# EAGLE design untitled (EAGLE 5.06)
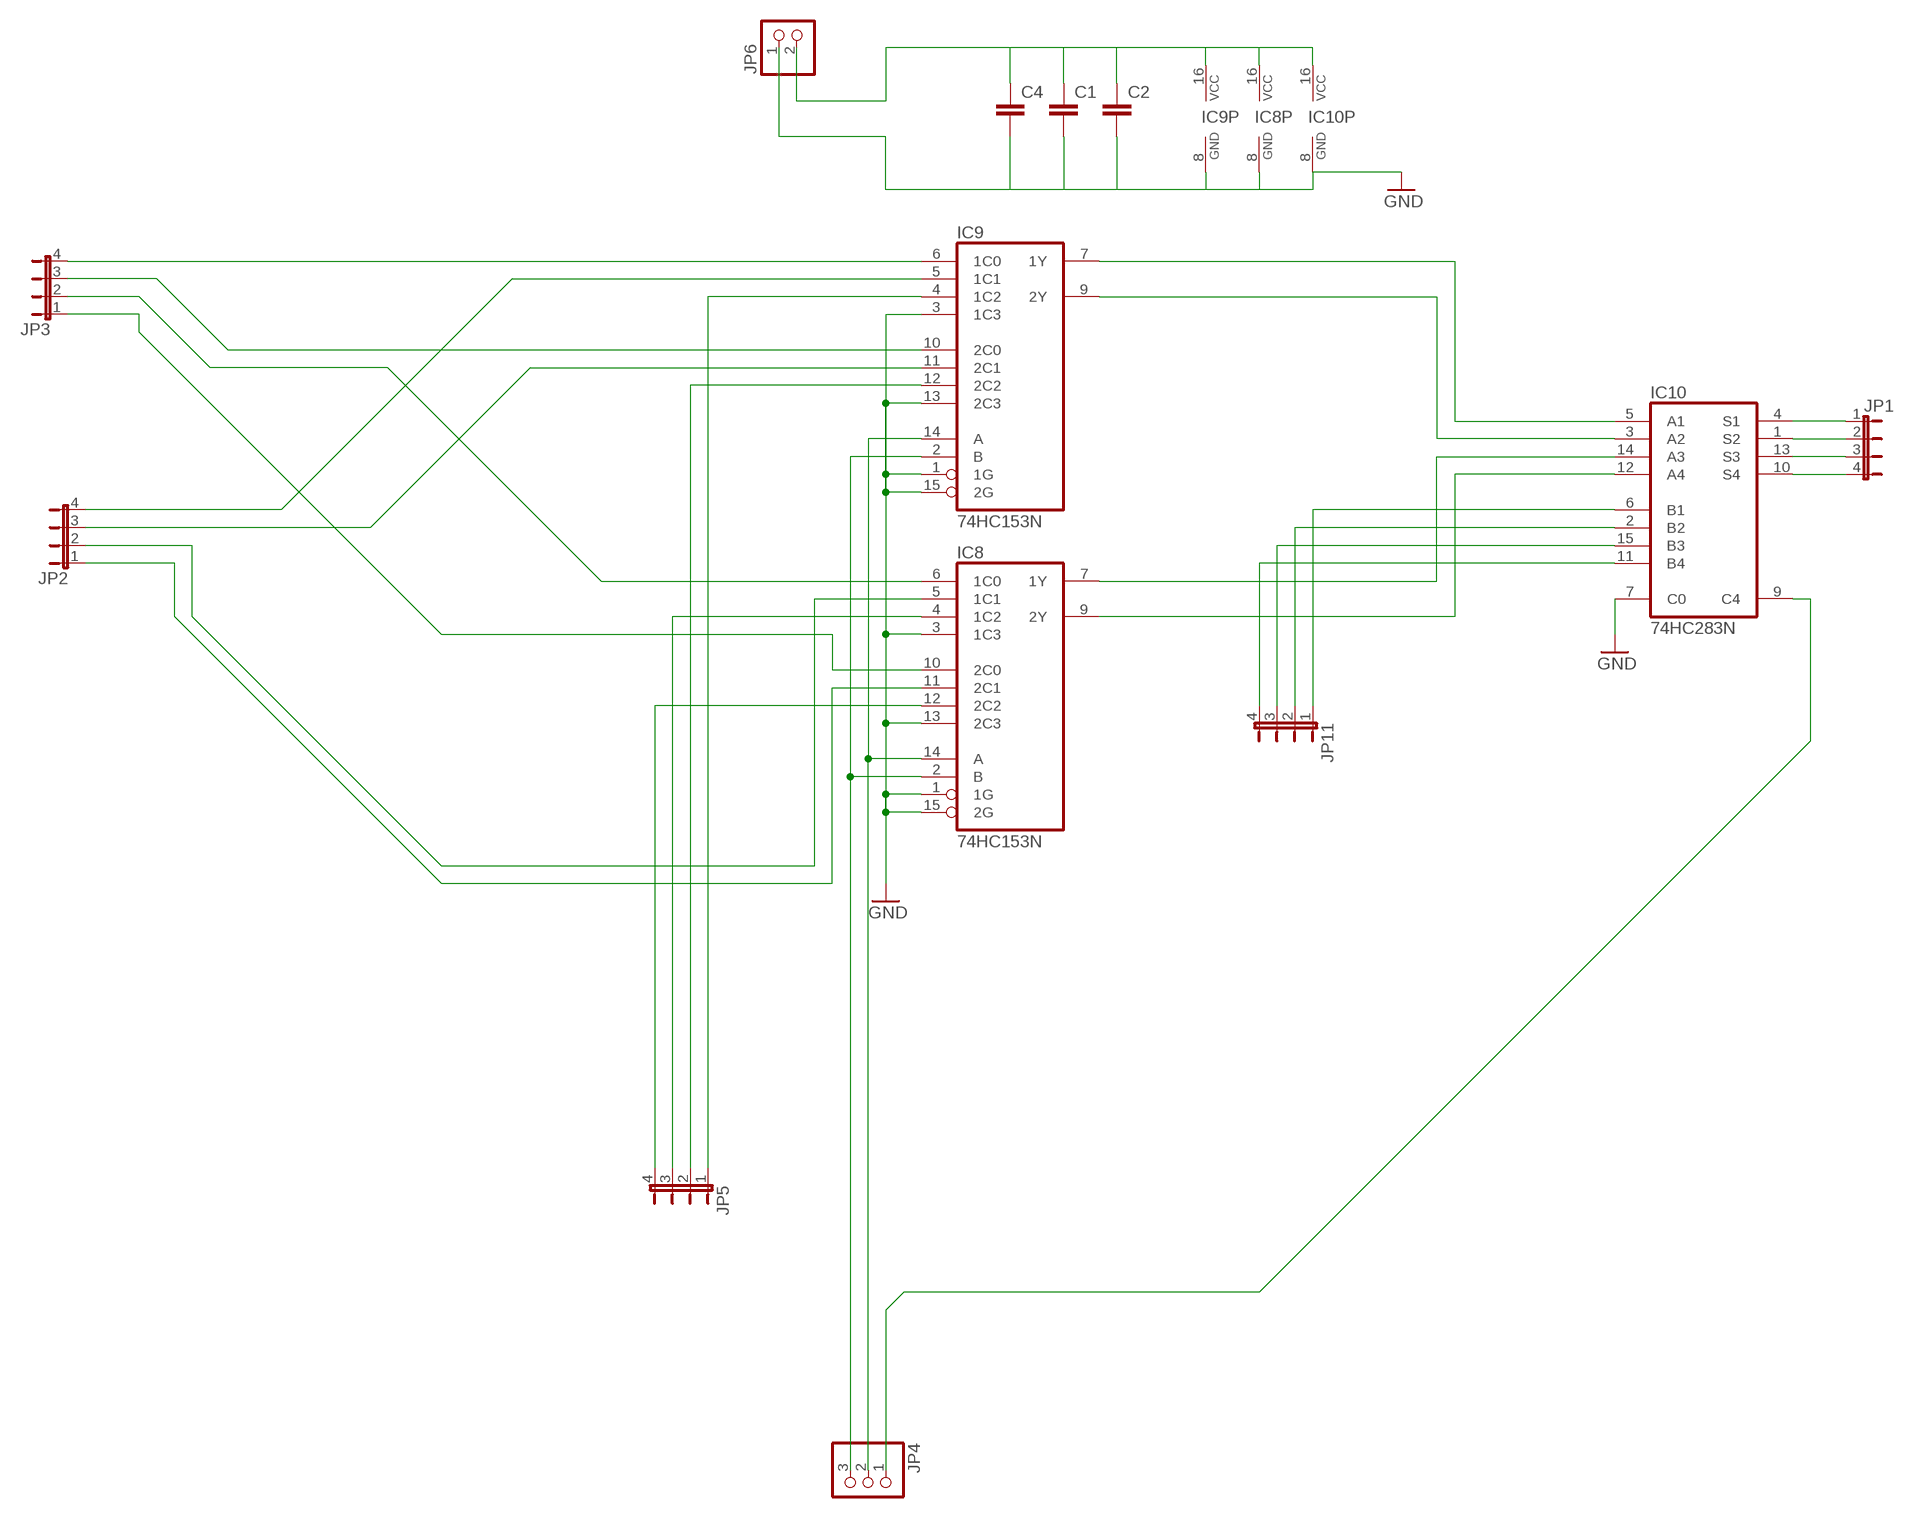
[diagram p0: schematic, sheet 1]

## Parts
C1  C-EU050-030X075  [C050-030X075]
C2  C-EU050-030X075  [C050-030X075]
C4  C-EU050-030X075  [C050-030X075]
IC8  74HC153N  [DIL16]
IC9  74HC153N  [DIL16]
IC10  74HC283N  [DIL16]
JP1  JP4E  [JP4]
JP2  JP4E  [JP4]
JP3  JP4E  [JP4]
JP4  PINHD-1X3  [1X03]
JP5  JP4E  [JP4]
JP6  PINHD-1X2  [1X02]
JP11  JP4E  [JP4]

## Nets
GND: C1.2 C2.2 C4.2 IC8.1(1G) IC8.3(1C3) IC8.8(GND) IC8.13(2C3) IC8.15(2G) IC9.1(1G) IC9.3(1C3) IC9.8(GND) IC9.13(2C3) IC9.15(2G) IC10.7(C0) IC10.8(GND) JP6.1
N$2: C1.1 C2.1 C4.1 IC8.16(VCC) IC9.16(VCC) IC10.16(VCC) JP6.2
N$149: IC9.7(1Y) IC10.5(A1)
N$150: IC9.9(2Y) IC10.3(A2)
N$152: IC8.7(1Y) IC10.14(A3)
N$154: IC8.9(2Y) IC10.12(A4)
N$177: IC10.9(C4) JP4.1
N$182: IC8.14(A) IC9.14(A) JP4.2
N$183: IC10.11(B4) JP11.4
N$184: IC10.15(B3) JP11.3
N$185: IC10.2(B2) JP11.2
N$186: IC10.6(B1) JP11.1
N$190: IC8.2(B) IC9.2(B) JP4.3
N$196: IC8.11(2C1) JP2.1
N$197: IC8.10(2C0) JP3.1
N$198: IC8.5(1C1) JP2.2
N$199: IC8.6(1C0) JP3.2
N$200: IC9.6(1C0) JP3.4
N$201: IC9.10(2C0) JP3.3
N$202: IC9.5(1C1) JP2.4
N$203: IC9.11(2C1) JP2.3
N$204: IC8.12(2C2) JP5.4
N$205: IC8.4(1C2) JP5.3
N$206: IC9.12(2C2) JP5.2
N$207: IC9.4(1C2) JP5.1
N$212: IC10.13(S3) JP1.3
N$214: IC10.10(S4) JP1.4
N$215: IC10.4(S1) JP1.1
N$216: IC10.1(S2) JP1.2

## Library data of the parts
C1 C2 C4 = resistor:C-EU: CAPACITOR, European symbol
IC8 IC9 = 74xx-eu:74*153: Dual 4-line to 1-line data SELECTOR/MULTIPLEXER
IC10 = 74xx-eu:74*283: 4-bit binary FULL ADDER, fast carry
JP1-JP3 JP5 JP11 = jumper:JP4E: JUMPER
JP4 = pinhead:PINHD-1X3: PIN HEADER
JP6 = pinhead:PINHD-1X2: PIN HEADER

## Board
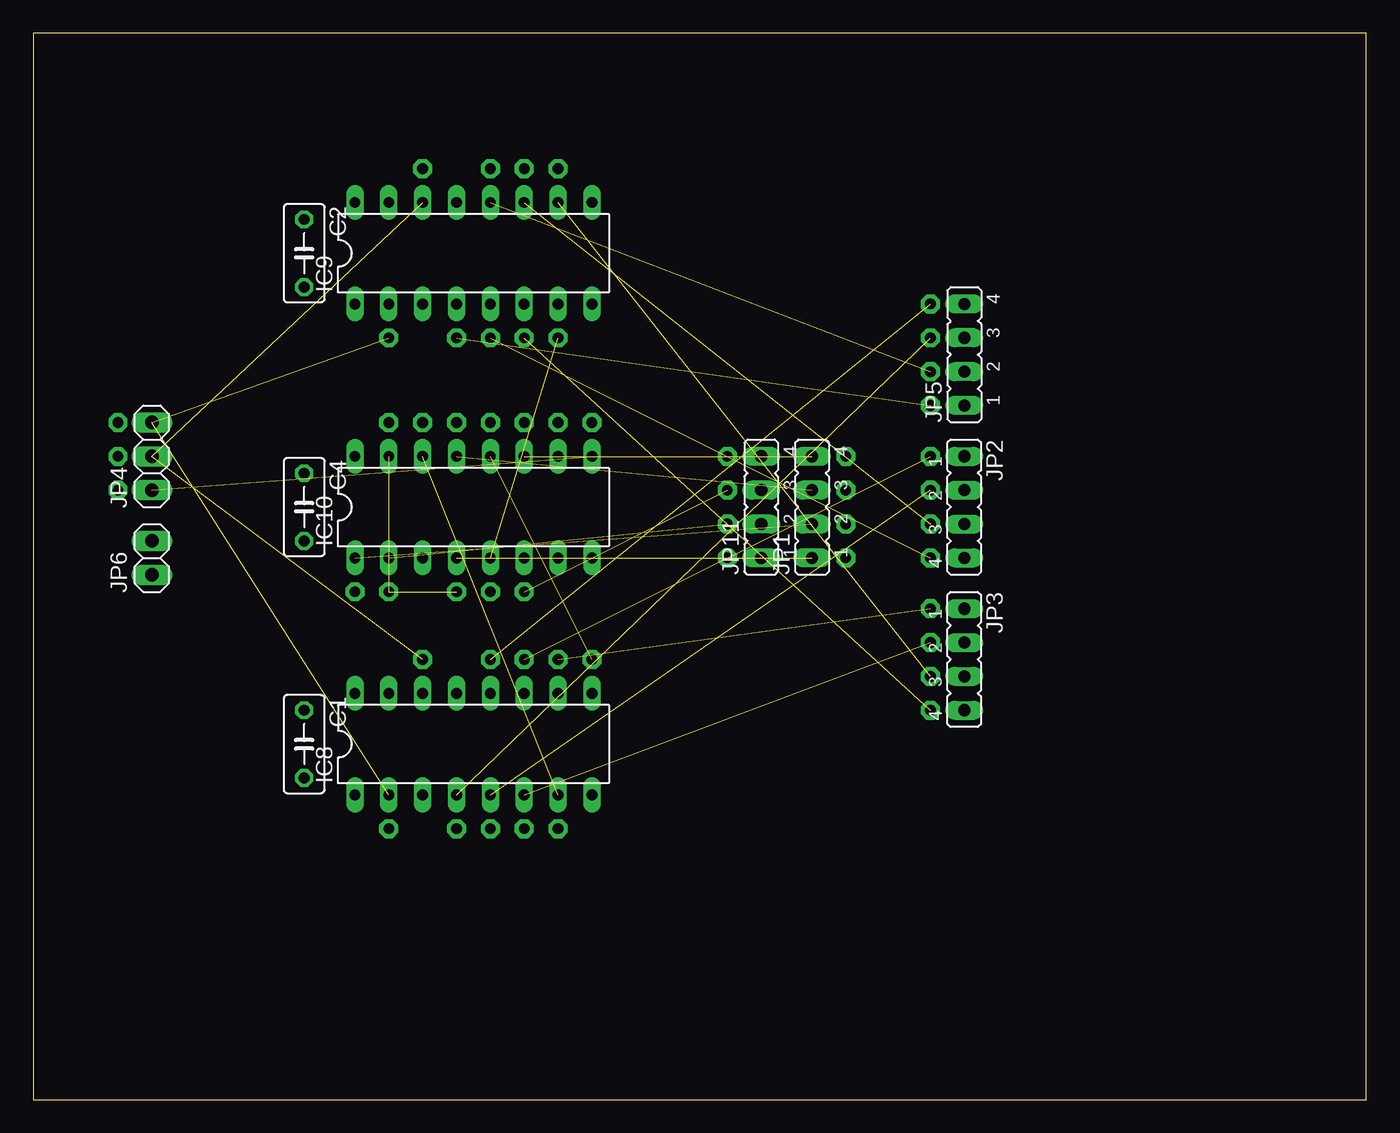
[diagram p1: board, top side]
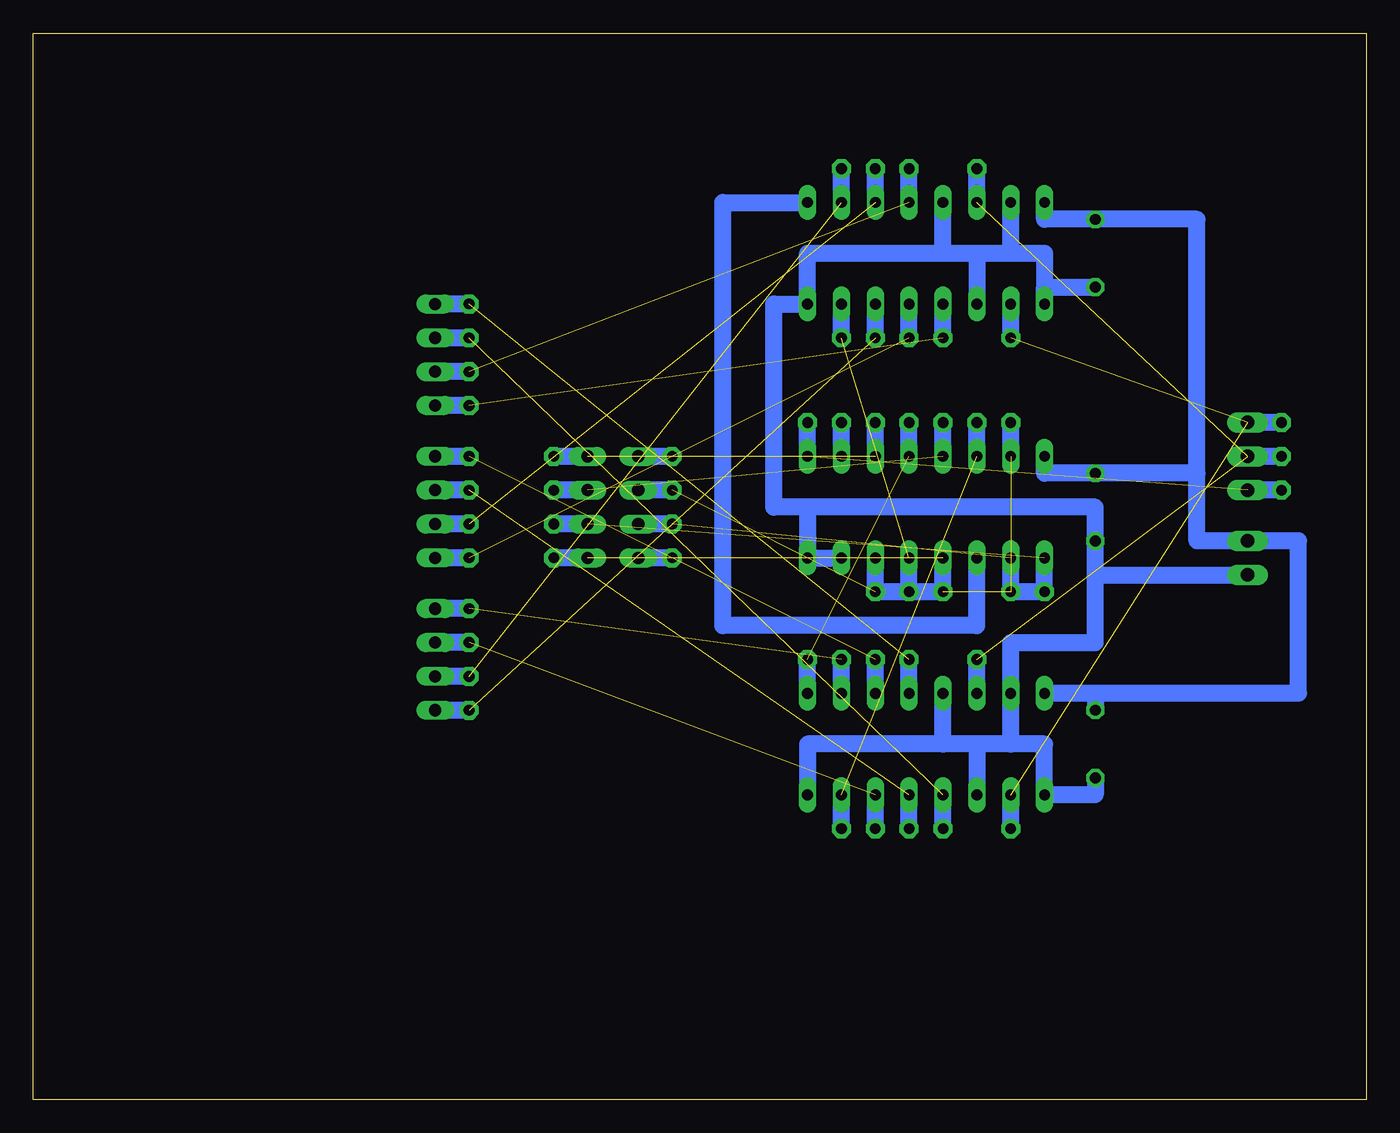
[diagram p2: board, bottom side, seen from below]

Size 100 x 80 mm. Coordinates in mm from the lower left corner, seen from the top.
Outline: 0,0 100,0 100,80 0,80 0,0
Copper layers (1*16): Top 0.035mm / dielectric 1.5mm / Bottom 0.035mm
Design rules "default": minimum track width 10mil, minimum drill 24mil, track to track 8mil, track to pad 8mil, pad to pad 8mil, via to via 8mil, smd to smd 8mil, copper to edge 40mil, drill to drill 8mil, minimum pad ring 10mil, minimum via ring 8mil, stop-mask expansion 4mil, vias tented up to drill 0mil, thermal gap 10mil

### Footprints (pad centres in the part's own frame; a part is rotated, then mirrored left to right if it is on the bottom)
C050-030X075 = drill 0.813 octagon: 1 -2.54,0; 2 2.54,0
DIL16 = drill 0.813 long: 1 -8.89,-3.81; 2 -6.35,-3.81; 3 -3.81,-3.81; 4 -1.27,-3.81; 5 1.27,-3.81; 6 3.81,-3.81; 7 6.35,-3.81; 8 8.89,-3.81; 9 8.89,3.81; 10 6.35,3.81; 11 3.81,3.81; 12 1.27,3.81; 13 -1.27,3.81; 14 -3.81,3.81; 15 -6.35,3.81; 16 -8.89,3.81
JP4 = drill 0.914 long: 1 -3.81,0; 2 -1.27,0; 3 1.27,0; 4 3.81,0
1X03 = drill 1.016 long: 1 -2.54,0; 2 0,0; 3 2.54,0
1X02 = drill 1.016 long: 1 -1.27,0; 2 1.27,0

### Placement (x,y rotation side)
C1  20.32,26.67 270 top
C2  20.32,63.5 270 top
C4  20.32,44.45 270 top
IC8  33.02,26.67 0 top
IC9  33.02,63.5 0 top
IC10  33.02,44.45 0 top
JP1  58.42,44.45 90 top
JP2  69.85,44.45 270 top
JP3  69.85,33.02 270 top
JP4  8.89,48.26 90 top
JP5  69.85,55.88 90 top
JP6  8.89,40.64 90 top
JP11  54.61,44.45 90 top

### Tracks (layer width: path | path; a pad name or v marks a point on that pad's centre or on a via)
GND
  Bottom 1.27: C2.2 24.13,60.96 IC9.1 24.13,63.5 26.67,63.5 | 29.21,63.5 26.67,63.5 | 31.75,63.5 29.21,63.5 | 31.75,63.5 41.91,63.5 IC9.8 44.45,59.69 44.45,44.45 41.91,44.45 | 31.75,63.5 IC9.13 | 26.67,63.5 IC9.15 | 29.21,63.5 IC9.3 | 41.91,44.45 20.32,44.45 C4.2 20.32,39.37 | 41.91,44.45 IC10.8 IC10.7 | C1.2 20.32,22.86 IC8.1 24.13,26.67 26.67,26.67 | 26.67,26.67 29.21,26.67 | 29.21,26.67 31.75,26.67 | 31.75,26.67 41.91,26.67 IC8.8 | 26.67,26.67 IC8.15 26.67,34.29 20.32,34.29 20.32,39.37 | 31.75,26.67 IC8.13 | 29.21,26.67 IC8.3 | 20.32,39.37 JP6.1
N$2
  Bottom 1.27: IC9.16 24.13,66.04 C2.1 12.7,66.04 12.7,46.99 | IC10.16 24.13,46.99 C4.1 12.7,46.99 | 20.32,30.48 C1.1 | 20.32,30.48 IC8.16 | 12.7,46.99 12.7,41.91 JP6.2 5.08,41.91 5.08,30.48 20.32,30.48
N$149  (1 unrouted)
  Bottom 1.27: 39.37,57.15 IC9.7 | 34.29,38.1 IC10.5
N$150
  Bottom 1.27: IC9.9 48.26,67.31 48.26,35.56 29.21,35.56 IC10.3
N$152  (via drill 0.8 pad 1.42)  (1 unrouted)
  Bottom 1.27: 39.37,20.32 IC8.7 | IC10.14 v29.21,50.8
N$154  (1 unrouted)
  Bottom 1.27: IC8.9 41.91,33.02 | IC10.12 34.29,50.8
N$177  (1 unrouted)
  Bottom 1.27: 6.35,45.72 JP4.1 | IC10.9 41.91,50.8
N$182  (2 unrouted)
  Bottom 1.27: 6.35,48.26 JP4.2 | IC8.14 29.21,33.02 | IC9.14 29.21,69.85
N$183  (1 unrouted)
  Bottom 1.27: 52.07,48.26 JP11.4 | IC10.11 36.83,50.8
N$184  (via drill 0.8 pad 1.42)  (3 unrouted)
  Bottom 1.27: 52.07,45.72 JP11.3 | IC10.15 v26.67,50.8 | v24.13,38.1 v26.67,38.1 | v31.75,38.1 v34.29,38.1 | v34.29,38.1 v36.83,38.1 v34.29,38.1
N$185  (1 unrouted)
  Bottom 1.27: 52.07,43.18 JP11.2 | 26.67,38.1 IC10.2
N$186  (1 unrouted)
  Bottom 1.27: 52.07,40.64 JP11.1 | 36.83,38.1 IC10.6
N$190  (2 unrouted)
  Bottom 1.27: 6.35,50.8 JP4.3 | 26.67,20.32 IC8.2 | 26.67,57.15 IC9.2
N$196  (1 unrouted)
  Bottom 1.27: IC8.11 36.83,33.02 | 67.31,48.26 JP2.1
N$197  (1 unrouted)
  Bottom 1.27: IC8.10 39.37,33.02 | 67.31,36.83 JP3.1
N$198  (1 unrouted)
  Bottom 1.27: 34.29,20.32 IC8.5 | 67.31,45.72 JP2.2
N$199  (1 unrouted)
  Bottom 1.27: 36.83,20.32 IC8.6 | 67.31,34.29 JP3.2
N$200  (1 unrouted)
  Bottom 1.27: 67.31,29.21 JP3.4 | 36.83,57.15 IC9.6
N$201  (1 unrouted)
  Bottom 1.27: 67.31,31.75 JP3.3 | IC9.10 39.37,69.85
N$202  (1 unrouted)
  Bottom 1.27: 67.31,40.64 JP2.4 | 34.29,57.15 IC9.5
N$203  (1 unrouted)
  Bottom 1.27: 67.31,43.18 JP2.3 | IC9.11 36.83,69.85
N$204  (1 unrouted)
  Bottom 1.27: IC8.12 34.29,33.02 | 67.31,59.69 JP5.4
N$205  (1 unrouted)
  Bottom 1.27: 31.75,20.32 IC8.4 | 67.31,57.15 JP5.3
N$206  (1 unrouted)
  Bottom 1.27: 67.31,54.61 JP5.2 | IC9.12 34.29,69.85
N$207  (1 unrouted)
  Bottom 1.27: 67.31,52.07 JP5.1 | 31.75,57.15 IC9.4
N$212  (via drill 0.8 pad 1.42)  (1 unrouted)
  Bottom 1.27: JP1.3 60.96,45.72 | IC10.13 v31.75,50.8
N$214  (1 unrouted)
  Bottom 1.27: JP1.4 60.96,48.26 | IC10.10 39.37,50.8
N$215  (1 unrouted)
  Bottom 1.27: JP1.1 60.96,40.64 | 31.75,38.1 IC10.4
N$216  (1 unrouted)
  Bottom 1.27: JP1.2 60.96,43.18 | 24.13,38.1 IC10.1
S$1  (via drill 0.8 pad 1.42)
  other vias: 29.21,69.85
S$2  (via drill 0.8 pad 1.42)
  other vias: 34.29,69.85
S$3  (via drill 0.8 pad 1.42)
  other vias: 36.83,69.85
S$4  (via drill 0.8 pad 1.42)
  other vias: 39.37,69.85
S$5  (via drill 0.8 pad 1.42)
  other vias: 26.67,57.15
S$6  (via drill 0.8 pad 1.42)
  other vias: 31.75,57.15
S$7  (via drill 0.8 pad 1.42)
  other vias: 34.29,57.15
S$8  (via drill 0.8 pad 1.42)
  other vias: 36.83,57.15
S$9  (via drill 0.8 pad 1.42)
  other vias: 39.37,57.15
S$13  (via drill 0.8 pad 1.42)
  other vias: 34.29,50.8
S$14  (via drill 0.8 pad 1.42)
  other vias: 36.83,50.8
S$15  (via drill 0.8 pad 1.42)
  other vias: 39.37,50.8
S$16  (via drill 0.8 pad 1.42)
  other vias: 41.91,50.8
S$17  (via drill 0.8 pad 1.42)
  other vias: 29.21,33.02
S$18  (via drill 0.8 pad 1.42)
  other vias: 34.29,33.02
S$19  (via drill 0.8 pad 1.42)
  other vias: 36.83,33.02
S$20  (via drill 0.8 pad 1.42)
  other vias: 39.37,33.02
S$21  (via drill 0.8 pad 1.42)
  other vias: 41.91,33.02
S$22  (via drill 0.8 pad 1.42)
  other vias: 39.37,20.32
S$23  (via drill 0.8 pad 1.42)
  other vias: 36.83,20.32
S$24  (via drill 0.8 pad 1.42)
  other vias: 34.29,20.32
S$25  (via drill 0.8 pad 1.42)
  other vias: 31.75,20.32
S$26  (via drill 0.8 pad 1.42)
  other vias: 26.67,20.32
S$27  (via drill 0.8 pad 1.42)
  other vias: 6.35,50.8
S$28  (via drill 0.8 pad 1.42)
  other vias: 6.35,48.26
S$29  (via drill 0.8 pad 1.42)
  other vias: 6.35,45.72
S$30  (via drill 0.8 pad 1.42)
  other vias: 52.07,48.26
S$31  (via drill 0.8 pad 1.42)
  other vias: 52.07,45.72
S$32  (via drill 0.8 pad 1.42)
  other vias: 52.07,43.18
S$33  (via drill 0.8 pad 1.42)
  other vias: 52.07,40.64
S$34  (via drill 0.8 pad 1.42)
  other vias: 60.96,40.64
S$35  (via drill 0.8 pad 1.42)
  other vias: 60.96,43.18
S$36  (via drill 0.8 pad 1.42)
  other vias: 60.96,45.72
S$37  (via drill 0.8 pad 1.42)
  other vias: 60.96,48.26
S$38  (via drill 0.8 pad 1.42)
  other vias: 67.31,59.69
S$39  (via drill 0.8 pad 1.42)
  other vias: 67.31,57.15
S$40  (via drill 0.8 pad 1.42)
  other vias: 67.31,54.61
S$41  (via drill 0.8 pad 1.42)
  other vias: 67.31,52.07
S$42  (via drill 0.8 pad 1.42)
  other vias: 67.31,48.26
S$43  (via drill 0.8 pad 1.42)
  other vias: 67.31,45.72
S$44  (via drill 0.8 pad 1.42)
  other vias: 67.31,43.18
S$45  (via drill 0.8 pad 1.42)
  other vias: 67.31,40.64
S$46  (via drill 0.8 pad 1.42)
  other vias: 67.31,36.83
S$47  (via drill 0.8 pad 1.42)
  other vias: 67.31,34.29
S$48  (via drill 0.8 pad 1.42)
  other vias: 67.31,31.75
S$49  (via drill 0.8 pad 1.42)
  other vias: 67.31,29.21